# EAGLE design iblock-energy-monitor (EAGLE 7.6.0)
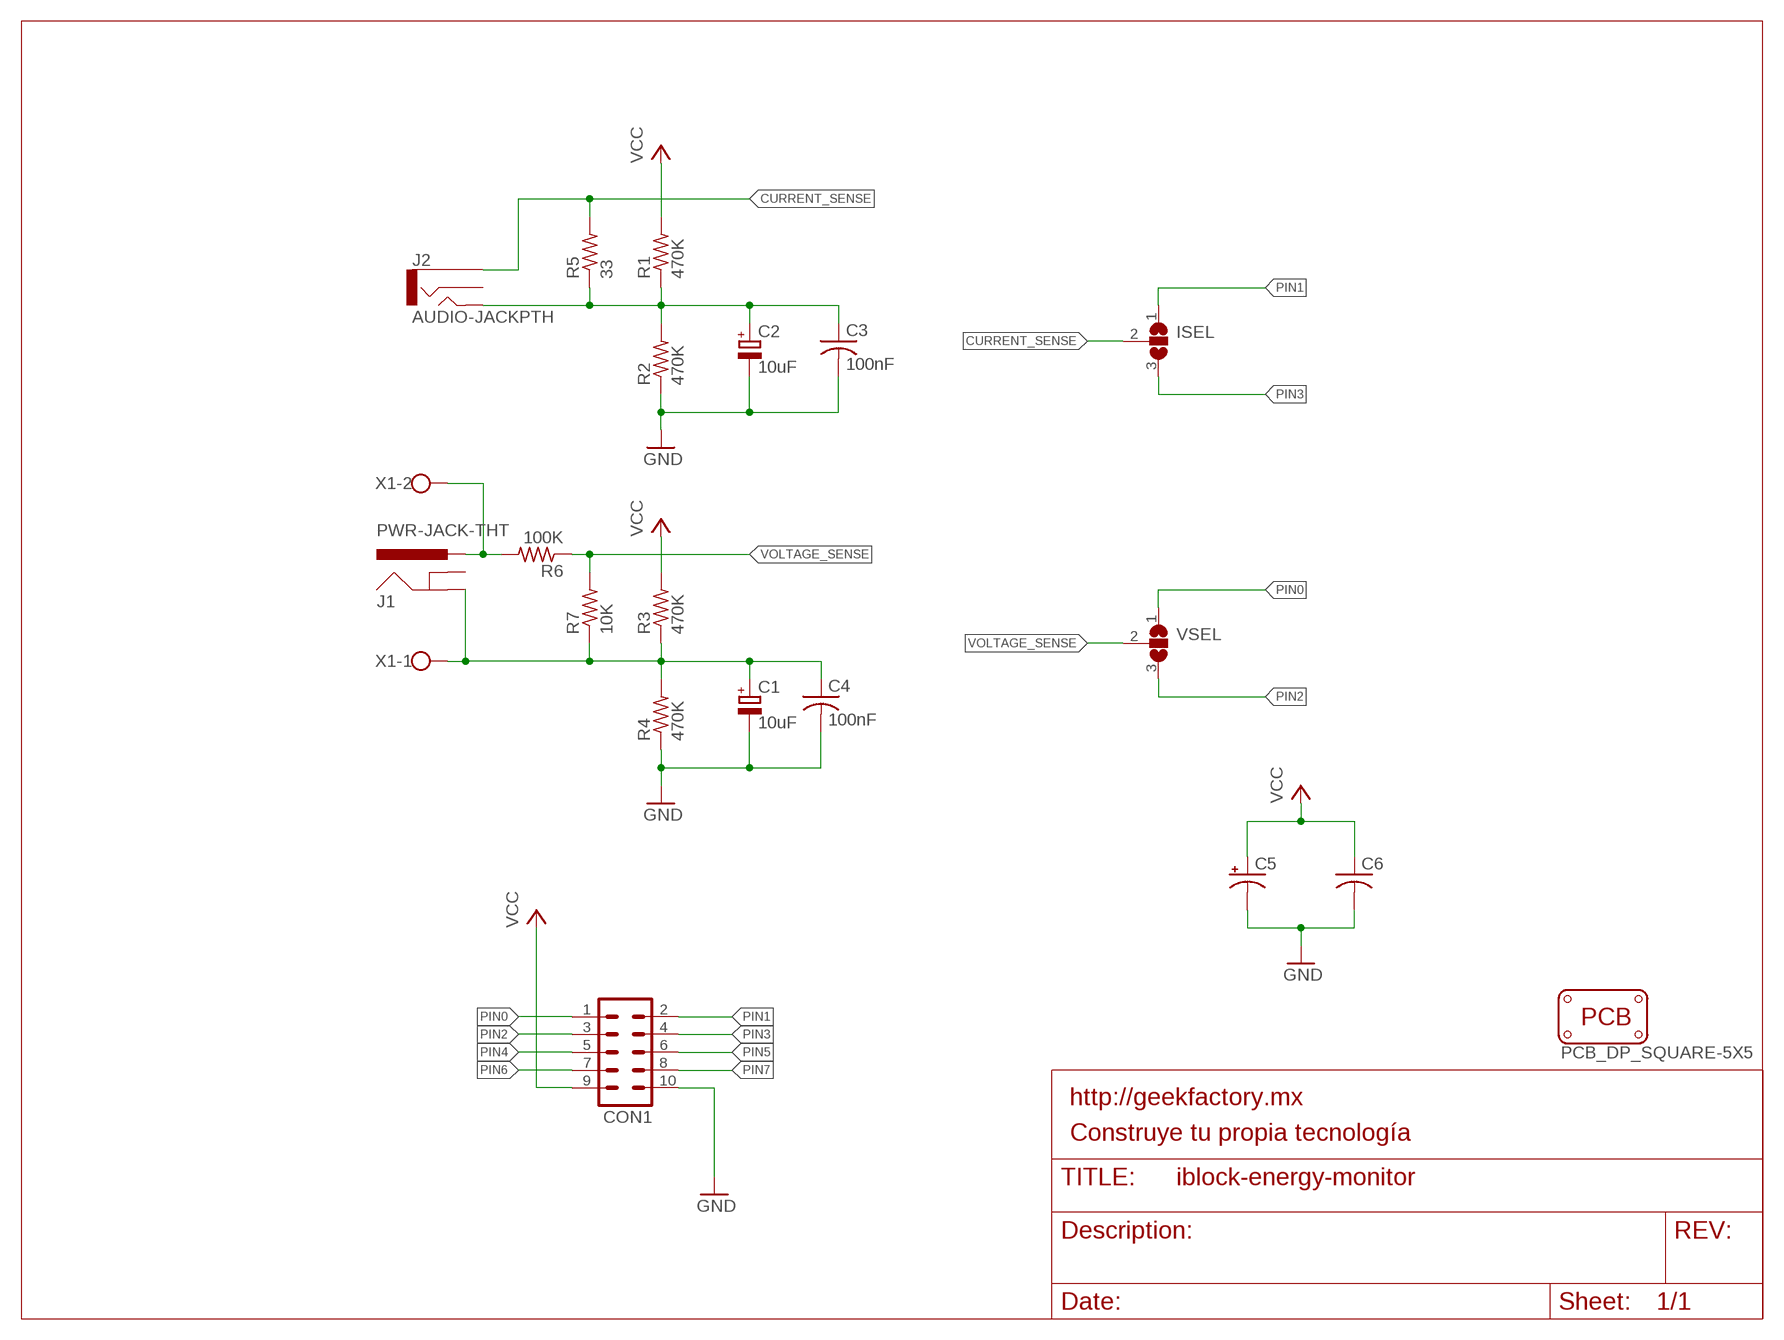
[diagram p0: schematic, sheet 1]

## Parts
C1  10uF  CPOL-EUE2.5-5  [E2,5-5]
C2  10uF  CPOL-EUE2.5-5  [E2,5-5]
C3  100nF  C-US050-024X044  [C050-024X044]
C4  100nF  C-US050-024X044  [C050-024X044]
C5  CPOL-USE3.5-8  [E3,5-8]
C6  C-US050-024X044  [C050-024X044]
CON1  MA05-2S  [MA05-2]
ISEL  SJ2W  [SJ_2]
J1  PWR-JACK-THT  [THT-PWR-JACK]
J2  AUDIO-JACKPTH  [AUDIO-JACK]
PCB1  PCB_DP_SQUARE-5X5  [DP5050_V1]
R1  470K  R-US_0207/10  [0207/10]
R2  470K  R-US_0207/10  [0207/10]
R3  470K  R-US_0207/10  [0207/10]
R4  470K  R-US_0207/10  [0207/10]
R5  33  R-US_0207/10  [0207/10]
R6  100K  R-US_0207/10  [0207/10]
R7  10K  R-US_0207/10  [0207/10]
VSEL  SJ2W  [SJ_2]
X1  W237-102  [W237-102]

## Nets
CURRENT_SENSE: ISEL.2 J2.1 R5.2
GND: C1.- C2.- C3.2 C4.2 C5.- C6.2 CON1.10 R2.1 R4.1
N$1: C1.+ C4.1 J1.GND R3.1 R4.2 R7.1 X1.1
N$3: C2.+ C3.1 J2.5 R1.1 R2.2 R5.1
N$4: J1.PWR R6.2 X1.2
PIN0: CON1.1 VSEL.1
PIN1: CON1.2 ISEL.1
PIN2: CON1.3 VSEL.3
PIN3: CON1.4 ISEL.3
PIN4: CON1.5
PIN5: CON1.6
PIN6: CON1.7
PIN7: CON1.8
VCC: C5.+ C6.1 CON1.9 R1.2 R3.2
VOLTAGE_SENSE: R6.1 R7.2 VSEL.2
Unconnected: J1.GNDBREAK J2.2

## Library data of the parts
C1 C2 = rcl:CPOL-EU: POLARIZED CAPACITOR, European symbol
C3 C4 C6 = rcl:C-US: CAPACITOR, American symbol
C5 = rcl:CPOL-US: POLARIZED CAPACITOR, American symbol
CON1 = various-electromechanical:MA05-2: PIN HEADER; OC_FARNELL: unknown; OC_NEWARK: unknown
ISEL VSEL = jumper:SJ2W: SMD solder JUMPER
J1 = various-electromechanical:PWR-JACK: Power Jack This is the standard 5.5mm barrel jack for power. The PTH is the most common, proven, reliable, footprint. All others are experimental. The Slot footprint only works if the mill layer is transmitted to the PCB fab house so be warned. Spark Fun Electronics SKU : PRT-00119. Mating wall wart : TOL-00298 (and others)
J2 = SparkFun:AUDIO-JACK: 3.5mm Audio Jack Simple 3.5mm common PCB mount audio jack. SKU: PRT-08032
PCB1 = dp_pcb:PCB_DP_SQUARE: Dangerous Prototypes Standard Square PCB sizes
R1-R7 = resistor:R-US_: RESISTOR, American symbol
X1 = con-wago-500:W237-102: WAGO SCREW CLAMP; MPN: 237-102; OC_FARNELL: unknown; OC_NEWARK: 70K9898

## Board
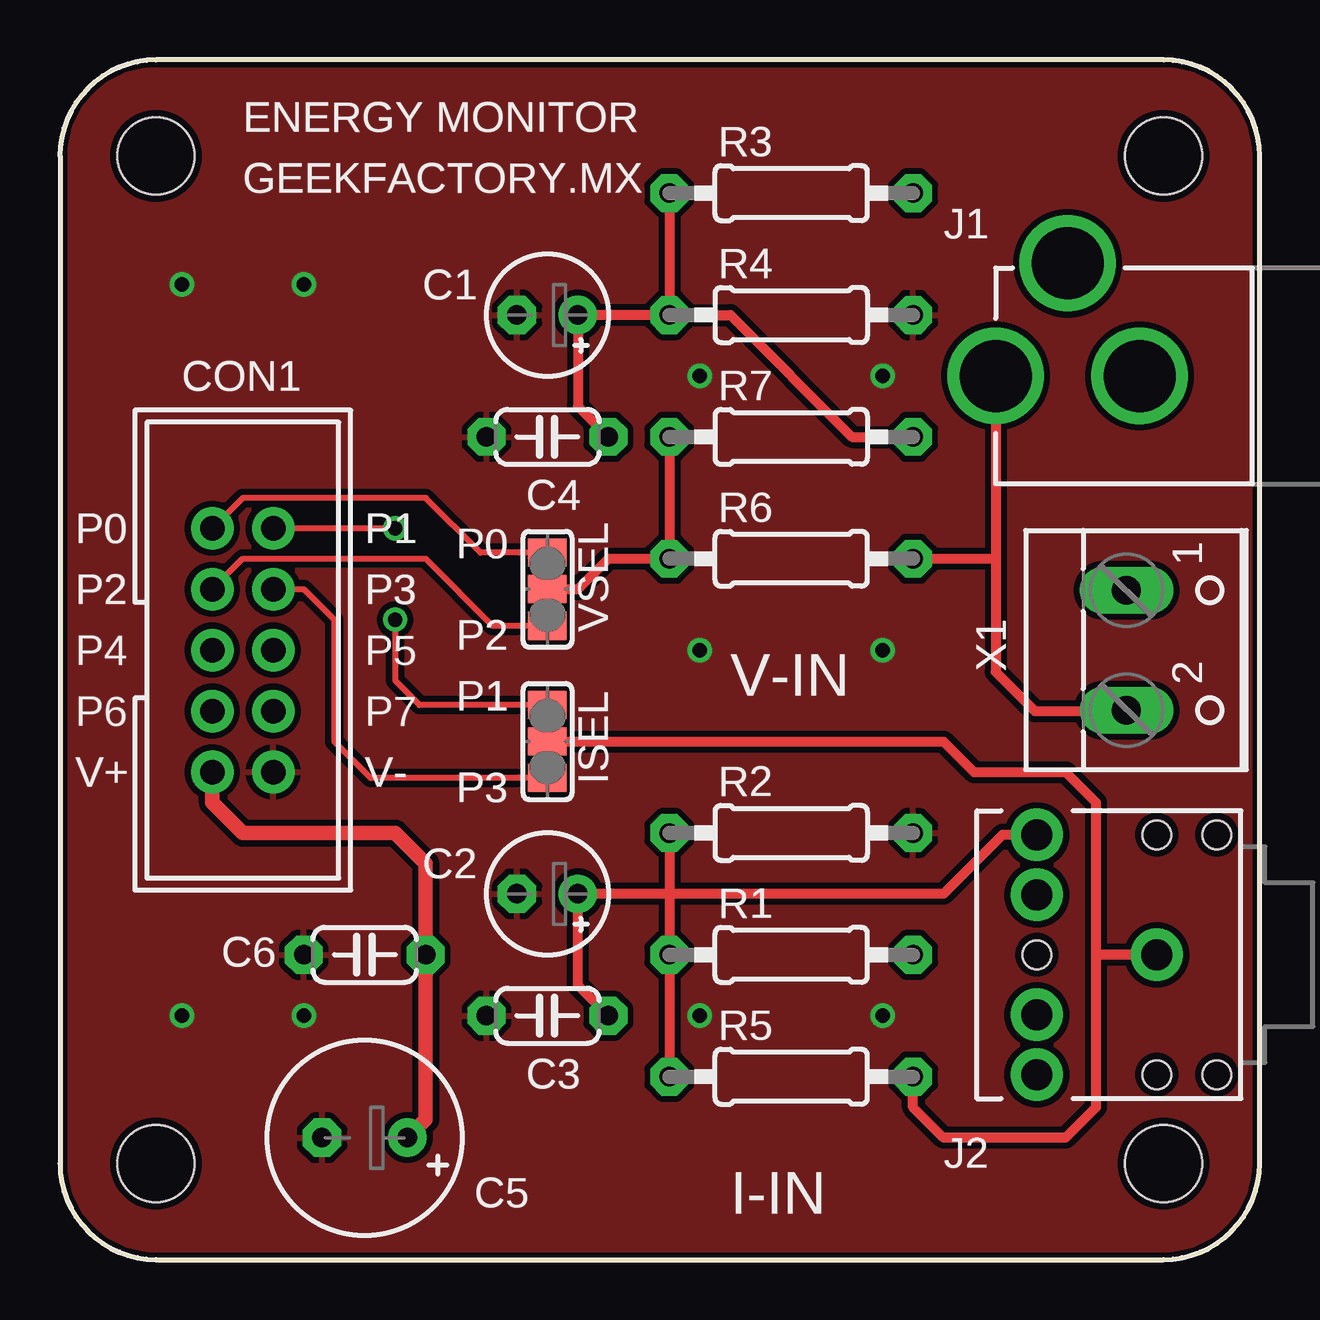
[diagram p1: board, top side]
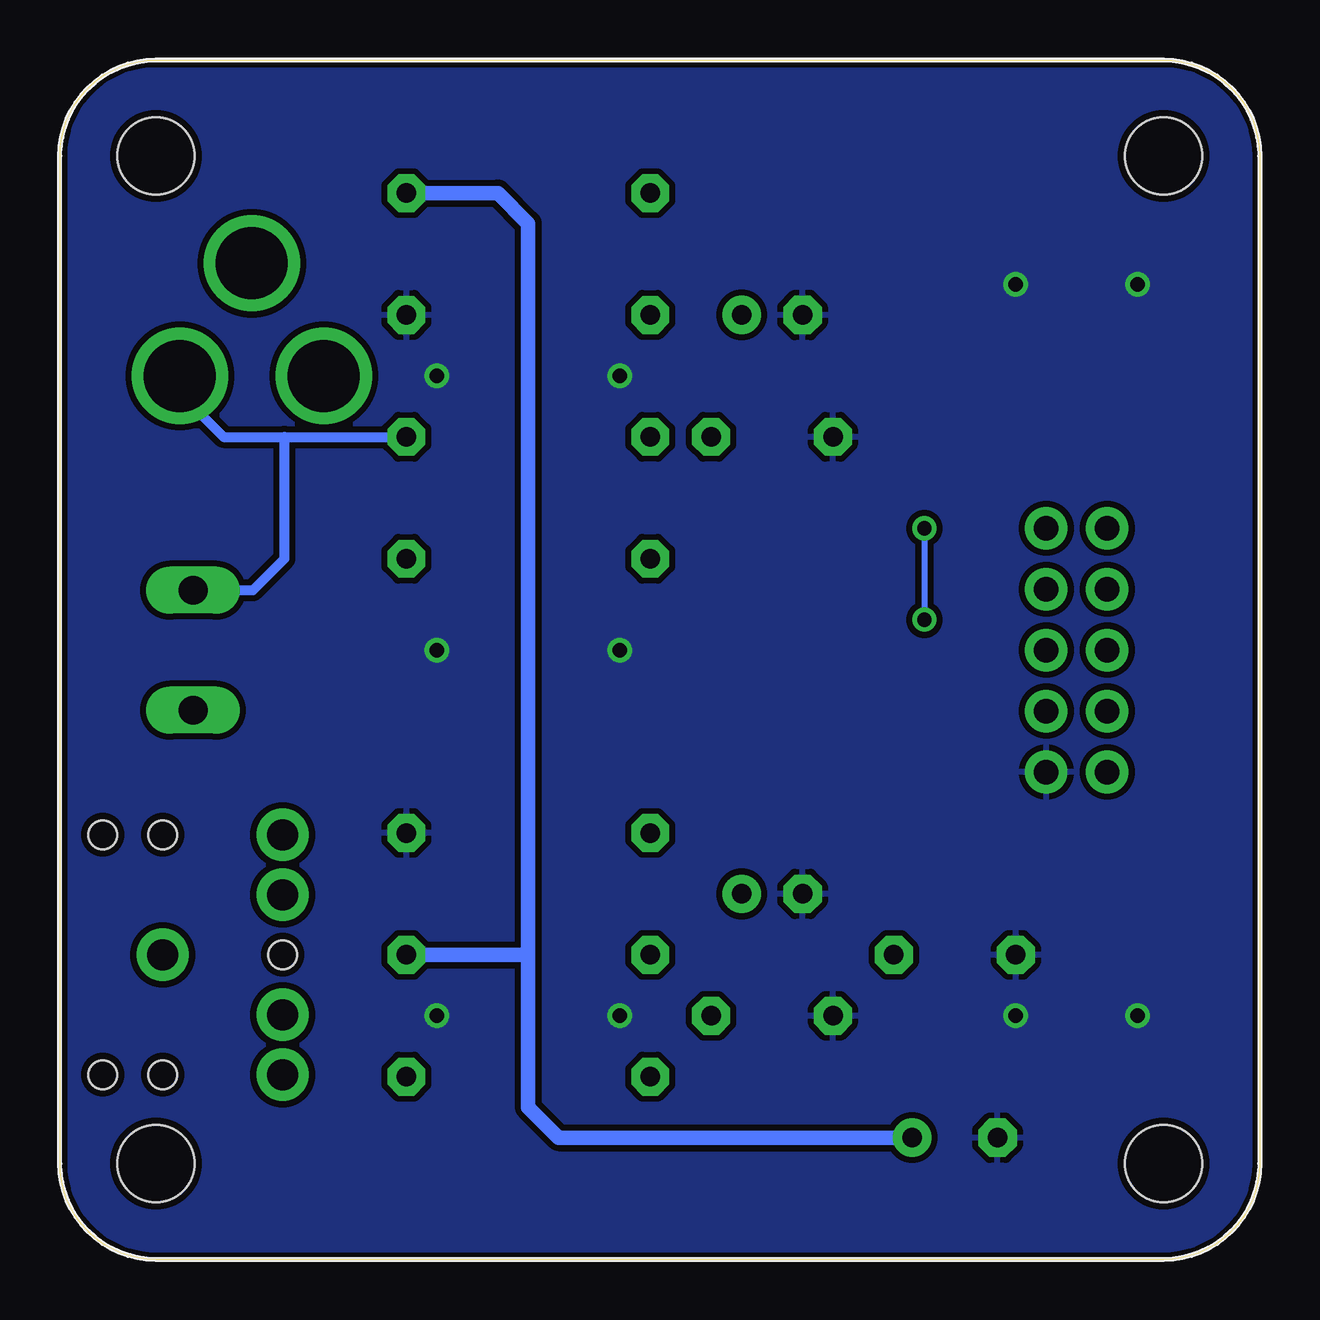
[diagram p2: board, bottom side, seen from below]

Size 50 x 50 mm. Coordinates in mm from the lower left corner, seen from the top.
Copper layers (1*16): Top 0.035mm / dielectric 1.5mm / Bottom 0.035mm
Design rules "10mil_generic": minimum track width 10mil, minimum drill 0.6mm, track to track 10mil, track to pad 10mil, pad to pad 10mil, via to via 10mil, smd to smd 10mil, copper to edge 12mil, drill to drill 8mil, minimum pad ring 15mil, minimum via ring 8mil, stop-mask expansion 4mil, vias tented up to drill 0.6mm, thermal gap 10mil

### Footprints (pad centres in the part's own frame; a part is rotated, then mirrored left to right if it is on the bottom)
E2,5-5 = drill 0.813 pad 1.6: + -1.27,0 | drill 0.813 pad 1.6 octagon: - 1.27,0
C050-024X044 = drill 0.813 octagon: 1 -2.54,0; 2 2.54,0
E3,5-8 = drill 0.813 pad 1.6: + -1.778,0 | drill 0.813 pad 1.6 octagon: - 1.778,0
MA05-2 = drill 1.016: 1 -1.27,5.08; 2 1.27,5.08; 3 -1.27,2.54; 4 1.27,2.54; 5 -1.27,0; 6 1.27,0; 7 -1.27,-2.54; 8 1.27,-2.54; 9 -1.27,-5.08; 10 1.27,-5.08
SJ_2 = smd 1.168 x 1.6: 1 -1.524,0; 2 0,0; 3 1.524,0
THT-PWR-JACK = drill 2.997: GND 0,0.715; GNDBREAK 4.7,3.715; PWR 0,6.715
AUDIO-JACK = drill 1.3 pad 2.184: 1 0,0; 2 5,5; 3 5,2.5; 4 5,-2.5; 5 5,-5 | hole 1.2: 0,5; -2.5,5; -2.5,-5; 0,-5; 5,0
DP5050_V1 = hole 3.2: 46,46; 4,46; 4,4; 46,4
0207/10 = drill 0.813 octagon: 1 -5.08,0; 2 5.08,0
W237-102 = drill 1.194 long: 1 -2.5,-1.27; 2 2.5,-1.27

### Placement (x,y rotation side)
C1  20.32,39.37 180 top
C2  20.32,15.24 180 top
C3  20.32,10.16 180 top
C4  20.32,34.29 180 top
C5  12.7,5.08 180 top
C6  12.7,12.7 180 top
CON1  7.62,25.4 0 top
ISEL  20.32,21.59 270 top
J1  45.72,36.83 90 top
J2  45.72,12.7 180 top
PCB1  0,0 0 top
R1  30.48,12.7 0 top
R2  30.48,17.78 180 top
R3  30.48,44.45 0 top
R4  30.48,39.37 180 top
R5  30.48,7.62 0 top
R6  30.48,29.21 0 top
R7  30.48,34.29 180 top
VSEL  20.32,27.94 270 top
X1  45.72,25.4 270 top

### Tracks (layer width: path | path; a pad name or v marks a point on that pad's centre or on a via)
CURRENT_SENSE
  Top 0.406: R5.2 35.56,6.35 36.83,5.08 41.91,5.08 43.18,6.35 43.18,12.7 | ISEL.2 36.83,21.59 38.1,20.32 41.91,20.32 43.18,19.05 43.18,12.7 | J2.1 43.18,12.7
GND  (via drill 0.6 pad 1.02)
  other vias: 5.08,10.16 5.08,40.64 10.16,40.64 10.16,10.16 26.67,36.83 26.67,25.4 34.29,25.4 34.29,36.83 26.67,10.16 34.29,10.16
  pour Top: 0,50.16 50.16,50.16 50.16,0 0,0
  pour Bottom: 0,0 0,50.16 50.16,50.16 50.16,0
N$1
  Top 0.406: R3.1 R4.2 | R4.2 27.94,39.37 33.02,34.29 R7.1 | R4.2 C1.+ 21.59,35.56 C4.1
  Bottom 0.406: J1.GND 45.01,36.12 43.18,34.29 40.64,34.29 | 40.64,34.29 R7.1 | X1.1 41.95,27.9 40.64,29.21 40.64,34.29
N$3
  Top 0.406: R2.2 25.4,15.24 | 25.4,15.24 R1.1 R5.1 | J2.5 39.29,17.7 36.83,15.24 25.4,15.24 | 25.4,15.24 C2.+ 21.59,11.43 C3.1
N$4
  Top 0.406: J1.PWR 39.01,29.21 | 39.01,29.21 39.01,24.5 40.64,22.86 44.45,22.86 X1.2 | R6.2 39.01,29.21
PIN0
  Top 0.254: VSEL.1 17.53,29.46 15.24,31.75 7.62,31.75 CON1.1
PIN1  (via drill 0.6)
  Top 0.254: v13.97,26.67 13.97,24.13 14.99,23.11 ISEL.1 | CON1.2 v13.97,30.48
  Bottom 0.254: v13.97,30.48 v13.97,26.67
PIN2
  Top 0.254: VSEL.3 18.03,26.42 15.24,29.21 7.62,29.21 CON1.3
PIN3
  Top 0.254: ISEL.3 12.95,20.07 11.43,21.59 11.43,26.67 10.16,27.94 CON1.4
VCC
  Top 0.61: C5.+ 15.24,5.84 C6.1 15.24,16.51 13.97,17.78 7.62,17.78 6.35,19.05 CON1.9
  Bottom 0.61: R3.2 31.75,44.45 30.48,43.18 30.48,12.7 | 30.48,12.7 30.48,6.35 29.21,5.08 C5.+ | R1.2 30.48,12.7
VOLTAGE_SENSE
  Top 0.406: R7.2 R6.1 22.86,29.21 21.59,27.94 VSEL.2

### Text on the board
tPlace: ENERGY MONITOR | GEEKFACTORY.MX | P0 | P2 | P1 | V-IN | P3 | I-IN
_tsilk: ENERGY MONITOR | R3 | GEEKFACTORY.MX | J1 | R4 | C1 | CON1 | R7 | C4 | R6 | P0 | P1 | 1 | P0 | P2 | P3 | X1 | VSEL | P2 | 2 | P1 | V-IN | V+ | V- | ISEL | P3 | R2 | C2 | R1 | C6 | R5 | C3 | J2 | C5 | I-IN